# Altium schematic sheet Sema_Napajanje_EUROBOT-2016.SchDoc: Napajanje EUROBOT-2016
size A4; ApprovedBy: Miailo Stefanovic; Author: Mihailo Stefanovic; CompanyName: VISER; DrawnBy: Mihailo Stefanovic; Address1: Napajanje; Address2: za; Address3: EUROBOT; Address4: Takmicenje; SheetNumber: 1; SheetTotal: 1; Application_BuildNumber: 0001
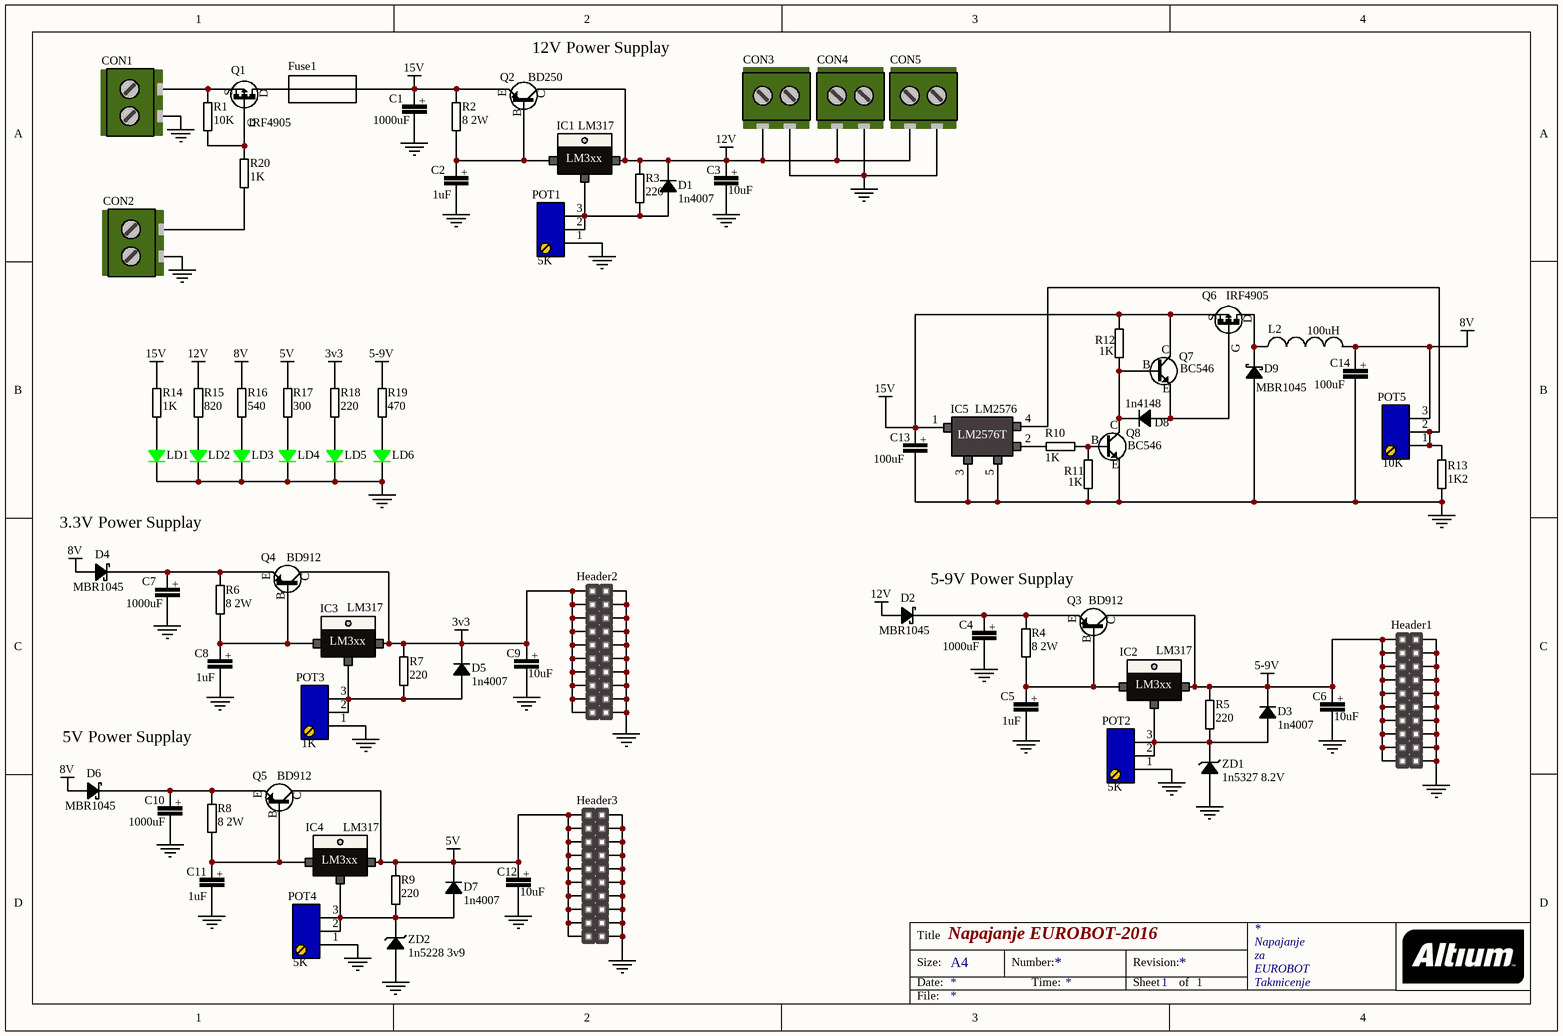
[diagram p0: Sema_Napajanje_EUROBOT-2016.SchDoc]

## Parts
C1  1000uF  [C2(elektrolit)]
C2  1uF  [C1(ceramic)]
C3  10uF  [C3]
C4  1000uF  [C2(elektrolit)]
C5  1uF  [C2(elektrolit)]
C6  10uF  [C3]
C7  1000uF  [C2(elektrolit)]
C8  1uF  [C1(ceramic)]
C9  10uF  [C3]
C10  1000uF  [C2(elektrolit)]
C11  1uF  [C1(ceramic)]
C12  10uF  [C3]
C13  100uF  [C3]
C14  100uF  [C3]
CON1  Klema  [Klema]  (value not drawn)
CON2  Klema  [Klema]  (value not drawn)
CON3  Klema  [Klema]  (value not drawn)
CON4  Klema  [Klema]  (value not drawn)
CON5  Klema  [Klema]  (value not drawn)
D1  1n4007  [D1(300milsa)]
D2  MBR1045  [D2(TO220)]
D3  1n4007  [D1(300milsa)]
D4  MBR1045  [D2(TO220)]
D5  1n4007  [D1(300milsa)]
D6  MBR1045  [D2(TO220)]
D7  1n4007  [D1(300milsa)]
D8  1n4148  [D1(300milsa)]
D9  MBR1045  [D2(TO220)]
Fuse1  FUSE  [Osigurac]  (value not drawn)
Header1  Header2x10  [HEADER2x10]  (value not drawn)
Header2  Header2x10  [HEADER2x10]  (value not drawn)
Header3  Header2x10  [HEADER2x10]  (value not drawn)
IC1  LM317  [TO220]
IC2  LM317  [TO220]
IC3  LM317  [TO220]
IC4  LM317  [TO220]
IC5  LM2576  [LM2576]
L2  100uH  [Kalem]
LD1  LED  [LED(3mm)]  (value not drawn)
LD2  LED  [LED(3mm)]  (value not drawn)
LD3  LED  [LED(3mm)]  (value not drawn)
LD4  LED  [LED(3mm)]  (value not drawn)
LD5  LED  [LED(3mm)]  (value not drawn)
LD6  LED  [LED(3mm)]  (value not drawn)
POT1  5K  [TRIM]
POT2  5K  [TRIM]
POT3  1K  [TRIM]
POT4  5K  [TRIM]
POT5  10K  [TRIM]
Q1  IRF4905  [TO220]
Q2  BD250  [TO218]
Q3  BD912  [TO220]
Q4  BD912  [TO220]
Q5  BD912  [TO220]
Q6  IRF4905  [TO220]
Q7  BC546  [BC327]
Q8  BC546  [BC327]
R1  10K  [R1(300milsa)]
R2  8 2W  [R1(2W)]
R3  220  [R1(300milsa)]
R4  8 2W  [R1(2W)]
R5  220  [R1(300milsa)]
R6  8 2W  [R1(2W)]
R7  220  [R1(300milsa)]
R8  8 2W  [R1(2W)]
R9  220  [R1(300milsa)]
R10  1K  [R1(300milsa)]
R11  1K  [R1(300milsa)]
R12  1K  [R1(300milsa)]
R13  1K2  [R1(300milsa)]
R14  1K  [R1(300milsa)]
R15  820  [R1(300milsa)]
R16  540  [R1(300milsa)]
R17  300  [R1(300milsa)]
R18  220  [R1(300milsa)]
R19  470  [R1(300milsa)]
R20  1K  [R1(300milsa)]
ZD1  1n5327 8.2V  [D1(300milsa)]
ZD2  1n5228 3v9  [D1(300milsa)]

## Nets
3v3: C9.1 D5.2 Header2.1 Header2.3 Header2.5 Header2.7 Header2.9 Header2.11 Header2.13 Header2.15 Header2.17 Header2.19 IC3.2 Q4.3 R7.2 R18.1
5-9V: C6.1 D3.2 Header1.1 Header1.3 Header1.5 Header1.7 Header1.9 Header1.11 Header1.13 Header1.15 Header1.17 Header1.19 IC2.2 Q3.3 R5.2 R19.1
5V: C12.1 D7.2 Header3.1 Header3.3 Header3.5 Header3.7 Header3.9 Header3.11 Header3.13 Header3.15 Header3.17 Header3.19 IC4.2 Q5.3 R9.2 R17.1
8V: C14.1 D4.1 D6.1 L2.2 POT5.3 R16.1
12V: C3.1 CON3.1 CON4.1 CON5.1 D1.2 D2.1 IC1.2 Q2.3 R3.2 R15.1
15V: C1.1 C13.1 Fuse1.2 IC5.1 Q2.2 Q6.3 Q7.2 R2.2 R12.1 R14.1
GND: C1.2 C2.2 C3.2 C4.2 C5.2 C6.2 C7.2 C8.2 C9.2 C10.2 C11.2 C12.2 C13.2 C14.2 CON1.1 CON2.1 CON3.2 CON4.2 CON5.2 D9.1 Header1.2 Header1.4 Header1.6 Header1.8 Header1.10 Header1.12 Header1.14 Header1.16 Header1.18 Header1.20 Header2.2 Header2.4 Header2.6 Header2.8 Header2.10 Header2.12 Header2.14 Header2.16 Header2.18 Header2.20 Header3.2 Header3.4 Header3.6 Header3.8 Header3.10 Header3.12 Header3.14 Header3.16 Header3.18 Header3.20 IC5.3 IC5.5 LD1.2 LD2.2 LD3.2 LD4.2 LD5.2 LD6.2 POT1.1 POT2.1 POT3.1 POT4.1 Q8.3 R11.2 R13.2 ZD1.1 ZD2.1
NetC2_1: C2.1 IC1.3 Q2.1 R2.1
NetC4_1: C4.1 D2.2 Q3.2 R4.2
NetC5_1: C5.1 IC2.3 Q3.1 R4.1
NetC7_1: C7.1 D4.2 Q4.2 R6.2
NetC8_1: C8.1 IC3.3 Q4.1 R6.1
NetC10_1: C10.1 D6.2 Q5.2 R8.2
NetC11_1: C11.1 IC4.3 Q5.1 R8.1
NetCON1_2: CON1.2 Q1.3 R1.2
NetCON2_2: CON2.2 R20.1
NetD1_1: D1.1 IC1.1 POT1.2 POT1.3 R3.1
NetD3_1: D3.1 IC2.1 POT2.2 POT2.3 R5.1 ZD1.2
NetD5_1: D5.1 IC3.1 POT3.2 POT3.3 R7.1
NetD7_1: D7.1 IC4.1 POT4.2 POT4.3 R9.1 ZD2.2
NetD8_1: D8.1 Q6.1 Q7.3
NetD8_2: D8.2 Q7.1 Q8.2 R12.2
NetD9_2: D9.2 L2.1 Q6.2
NetFuse1_1: Fuse1.1 Q1.2
NetIC5_2: IC5.2 R10.2
NetIC5_4: IC5.4 POT5.1 POT5.2 R13.1
NetLD1_1: LD1.1 R14.2
NetLD2_1: LD2.1 R15.2
NetLD3_1: LD3.1 R16.2
NetLD4_1: LD4.1 R17.2
NetLD5_1: LD5.1 R18.2
NetLD6_1: LD6.1 R19.2
NetQ1_1: Q1.1 R1.1 R20.2
NetQ8_1: Q8.1 R10.1 R11.1

## Notes on the sheet
- (near Q2) 12V Power Supplay
- 3.3V Power Supplay
- 5-9V Power Supplay
- 5V Power Supplay
- Title
- Size:
- Date:
- A4
- Number:
- Time:
- Revision:
- Sheet
- of
- File:
- (in symbol C2) +
- (in symbol LM317/LM350) LM3xx
- (in symbol LM2576) LM2576T
- (in symbol P-Channel MOSFET) S; D; G
- (in symbol Transistor NPN) C; B; E
- (in symbol Transistor PNP) E; C; B

## Library data of the parts
C1-C14 = C2
D1 D3 D5 D7 D8 = D1
D2 D4 D6 D9 = Sotki Diode
IC1-IC4 = LM317/LM350
L2 = Coil
POT1-POT5 = TRIM
Q1 Q6 = P-Channel MOSFET
Q2-Q5 = Transistor PNP
Q7 Q8 = Transistor NPN
R1-R20 = R1
ZD1 ZD2 = ZD1